# EAGLE design Lab 1 (EAGLE 9.5.0)
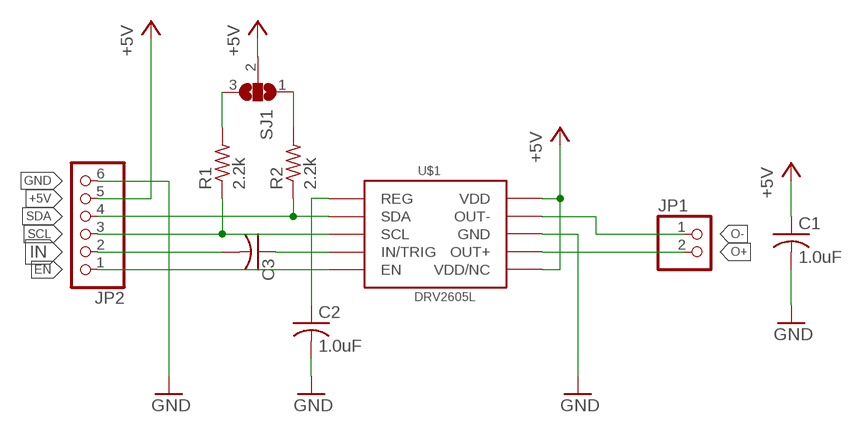
[diagram p0: schematic, sheet 1]

## Parts
C1  1.0uF  C-USC0805  [C0805]
C2  1.0uF  C-USC0805  [C0805]
C3  C-USC0805  [C0805]
JP1  PINHD-1X2  [1X02]
JP2  PINHD-1X6  [1X06]
R1  2.2k  R-US_R0805  [R0805]
R2  2.2k  R-US_R0805  [R0805]
SJ1  SJ2W  [SJ_2]
U$1  DRV2605L  [VSSOP-10]

## Nets
+5V: C1.1 JP2.5 SJ1.2 U$1.P$6(VDD/NC) U$1.P$10(VDD)
EN: JP2.1 U$1.P$5(EN)
GND: C1.2 C2.2 JP2.6 U$1.P$8(GND)
IN: C3.2 JP2.2
N$2: C3.1 U$1.P$4(IN/TRIG)
N$7: R1.2 SJ1.3
N$8: R2.2 SJ1.1
N$9: C2.1 U$1.P$1(REG)
O+: JP1.2 U$1.P$7(OUT+)
O-: JP1.1 U$1.P$9(OUT-)
SCL: JP2.3 R1.1 U$1.P$2(SCL)
SDA: JP2.4 R2.1 U$1.P$3(SDA)

## Library data of the parts
C1-C3 = rcl:C-US: CAPACITOR, American symbol; SPICEPREFIX: C
JP1 = pinhead:PINHD-1X2: PIN HEADER
JP2 = pinhead:PINHD-1X6: PIN HEADER
R1 R2 = rcl:R-US_: RESISTOR, American symbol; SPICEPREFIX: R
SJ1 = jumper:SJ2W: SMD solder JUMPER
U$1 = SparkFun-IC-Special-Function:DRV2605L; PROD_ID: IC-13504

## Board
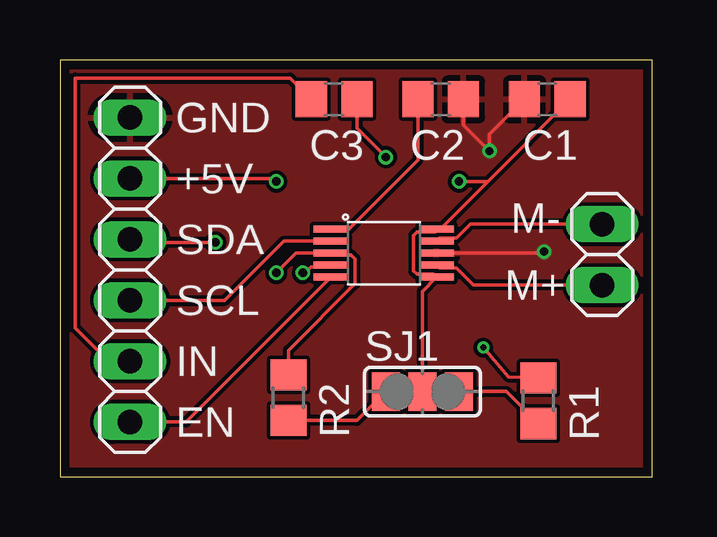
[diagram p1: board, top side]
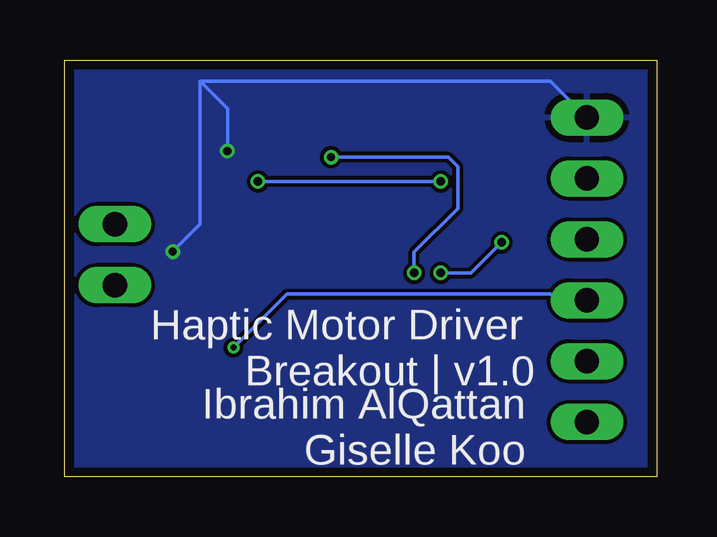
[diagram p2: board, bottom side, seen from below]

Size 24.69 x 17.39 mm. Coordinates in mm from the lower left corner, seen from the top.
Outline: 0,0 24.69,0 24.69,17.39 0,17.39 0,0
Copper layers (1*16): Top 0.035559375mm / dielectric 1.6mm / Bottom 0.035559375mm
Design rules "oshpark-2layer": minimum track width 6mil, minimum drill 10mil, track to track 6mil, track to pad 6mil, pad to pad 6mil, via to via 6mil, smd to smd 6mil, copper to edge 15mil, drill to drill 6mil, minimum pad ring 5mil, minimum via ring 5mil, stop-mask expansion 2.5mil, vias tented up to drill 0mil, thermal gap 10mil

### Footprints (pad centres in the part's own frame; a part is rotated, then mirrored left to right if it is on the bottom)
C0805 = smd 1.3 x 1.5: 1 -0.95,0; 2 0.95,0
1X02 = drill 1.016 long: 1 -1.27,0; 2 1.27,0
1X06 = drill 1.016 long: 1 -6.35,0; 2 -3.81,0; 3 -1.27,0; 4 1.27,0; 5 3.81,0; 6 6.35,0
R0805 = smd 1.3 x 1.5: 1 -0.95,0; 2 0.95,0
SJ_2 = smd 1.168 x 1.6: 1 -1.524,0; 2 0,0; 3 1.524,0
VSSOP-10 = smd 1.45 x 0.3: P$1 -1.905,1.06; P$2 -1.905,0.56; P$3 -1.905,0.06; P$4 -1.905,-0.44; P$5 -1.905,-0.94; P$6 2.495,-0.94; P$7 2.495,-0.44; P$8 2.495,0.06; P$9 2.495,0.56; P$10 2.495,1.06

### Placement (x,y rotation side)
C1  20.32,15.75 180 top
C2  15.88,15.75 0 top
C3  11.43,15.75 180 top
JP1  22.61,9.27 270 top
JP2  2.92,8.64 90 top
R1  19.94,3.17 270 top
R2  9.53,3.3 270 top
SJ1  15.11,3.56 0 top
U$1  13.21,9.27 0 top

### Tracks (layer width: path | path; a pad name or v marks a point on that pad's centre or on a via)
+5V  (via drill 0.35)
  Top 0.152: U$1.P$10 15.58,10.21 | 15.58,10.21 14.88,10.21 14.75,10.08 14.75,8.59 14.88,8.45 15.58,8.45 U$1.P$6 15.11,7.74 SJ1.2 | C1.1 17.84,12.32 | 17.84,12.32 15.78,10.26 15.7,10.26 15.65,10.21 15.58,10.21 | JP2.5 8.89,12.45 v9.02,12.32 | v16.64,12.32 17.84,12.32
  Bottom 0.152: v9.02,12.32 v16.64,12.32
EN
  Top 0.152: U$1.P$5 5.26,2.29 JP2.1
GND  (via drill 0.35)
  Top 0.152: U$1.P$8 20.13,9.33 v20.19,9.4 | C2.2 16.82,14.67 v17.91,13.59 17.91,14.29 C1.2
  Bottom 0.152: v20.19,9.4 19.05,10.54 19.05,16.51 | 19.05,16.51 4.45,16.51 JP2.6 | v17.91,13.59 17.91,15.37 19.05,16.51
  pour Bottom: 0,17.65 0,0 24.77,0 24.77,17.65
  pour Top: 0,17.4 0,0 24.77,0 24.77,17.4
IN
  Top 0.152: JP2.2 2.03,4.83 0.64,6.22 0.64,16.64 9.59,16.64 C3.2
N$2  (via drill 0.35)
  Top 0.152: U$1.P$4 11.23,8.76 10.46,8.76 10.12,8.42 v10.12,8.51 | v13.59,13.34 12.38,14.54 C3.1
  Bottom 0.152: v13.59,13.34 8.7,13.34 8.31,12.94 8.31,11.19 10.12,9.37 v10.12,8.51
N$7
  Top 0.152: SJ1.3 18.61,3.56 R1.2
N$8
  Top 0.152: SJ1.1 12.38,2.35 R2.2
N$9
  Top 0.152: U$1.P$1 12.05,10.33 14.93,13.21 C2.1
O+
  Top 0.152: U$1.P$7 15.82,8.71 16.52,8.71 17.23,8 JP1.2
O-
  Top 0.152: U$1.P$9 15.82,9.95 16.52,9.95 17.11,10.54 JP1.1
SCL  (via drill 0.25)
  Top 0.152: U$1.P$2 9.34,9.83 6.87,7.37 JP2.3 | v17.65,5.4 18.7,4.17 R1.1
  Bottom 0.152: v17.65,5.4 15.43,7.62 4.45,7.62 4.19,7.37 JP2.3
SDA  (via drill 0.35)
  Top 0.152: v9.02,8.51 9.84,9.33 U$1.P$3 11.37,9.26 12.14,9.26 12.31,9.1 12.31,8.06 9.53,5.28 R2.1 | v6.48,9.78 3.05,9.78 JP2.4
  Bottom 0.152: v9.02,8.51 7.75,8.51 v6.48,9.78

### Text on the board
tNames: GND | +5V | M- | SDA | SCL | M+ | IN | EN
bNames: Haptic Motor Driver / Breakout | v1.0 | Ibrahim AlQattan / Giselle Koo